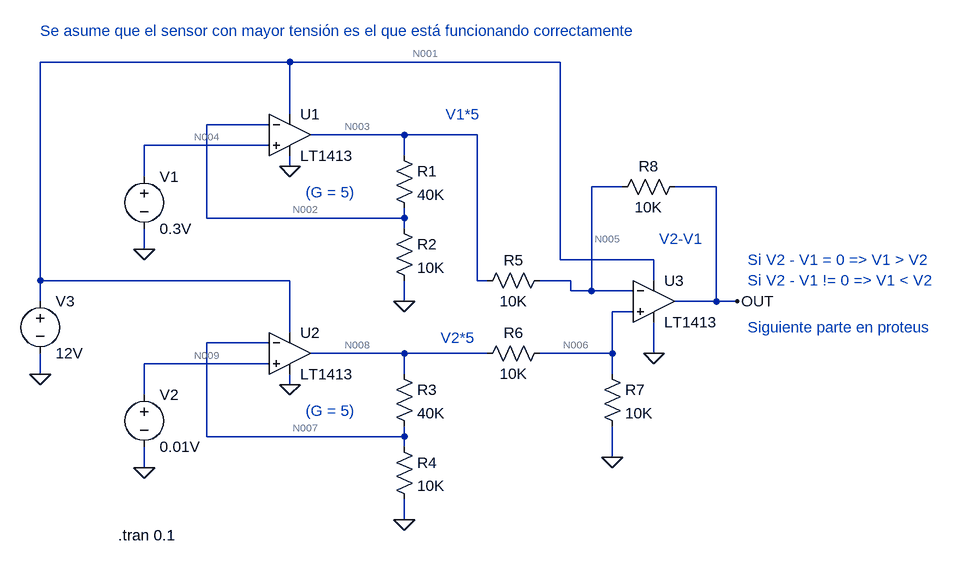
[diagram p0: schematic Draft2.asc]
Draft2.asc, the LTspice schematic file:
Version 4.1
SHEET 1 1600 708
WIRE 320 -48 -64 -48
WIRE 736 -48 320 -48
WIRE 320 32 320 -48
WIRE 288 48 192 48
WIRE 496 64 352 64
WIRE 608 64 496 64
WIRE 288 80 96 80
WIRE 496 96 496 64
WIRE 320 112 320 96
WIRE 96 128 96 80
WIRE 832 144 784 144
WIRE 976 144 912 144
WIRE 192 192 192 48
WIRE 496 192 496 176
WIRE 496 192 192 192
WIRE 496 208 496 192
WIRE 96 240 96 208
WIRE 736 256 736 -48
WIRE 880 256 736 256
WIRE -64 288 -64 -48
WIRE 320 288 -64 288
WIRE 608 288 608 64
WIRE 624 288 608 288
WIRE 752 288 704 288
WIRE 880 288 880 256
WIRE 752 304 752 288
WIRE 784 304 784 144
WIRE 784 304 752 304
WIRE 848 304 784 304
WIRE -64 320 -64 288
WIRE 496 320 496 288
WIRE 976 320 976 144
WIRE 976 320 912 320
WIRE 1008 320 976 320
WIRE 848 336 816 336
WIRE 320 368 320 288
WIRE 288 384 192 384
WIRE 496 400 352 400
WIRE 624 400 496 400
WIRE 816 400 816 336
WIRE 816 400 704 400
WIRE 880 400 880 352
WIRE 288 416 96 416
WIRE -64 432 -64 400
WIRE 496 432 496 400
WIRE 816 432 816 400
WIRE 320 448 320 432
WIRE 96 464 96 416
WIRE 192 528 192 384
WIRE 496 528 496 512
WIRE 496 528 192 528
WIRE 496 544 496 528
WIRE 816 560 816 512
WIRE 96 576 96 544
WIRE 496 656 496 624
FLAG 96 240 0
FLAG 496 320 0
FLAG 320 112 0
FLAG 96 576 0
FLAG 496 656 0
FLAG 320 448 0
FLAG -64 432 0
FLAG 816 560 0
FLAG 880 400 0
FLAG 1008 320 OUT
SYMBOL voltage 96 112 R0
SYMATTR InstName V1
SYMATTR Value 0.3V
SYMBOL OpAmps\\LT1413 320 0 R0
SYMATTR InstName U1
SYMBOL res 480 80 R0
SYMATTR InstName R1
SYMATTR Value 40K
SYMBOL res 480 192 R0
SYMATTR InstName R2
SYMATTR Value 10K
SYMBOL voltage 96 448 R0
WINDOW 123 0 0 Left 0
WINDOW 39 0 0 Left 0
SYMATTR InstName V2
SYMATTR Value 0.01V
SYMBOL OpAmps\\LT1413 320 336 R0
SYMATTR InstName U2
SYMBOL res 480 416 R0
SYMATTR InstName R3
SYMATTR Value 40K
SYMBOL res 480 528 R0
SYMATTR InstName R4
SYMATTR Value 10K
SYMBOL voltage -64 304 R0
SYMATTR InstName V3
SYMATTR Value 12V
SYMBOL res 720 272 R90
WINDOW 0 0 56 VBottom 2
WINDOW 3 32 56 VTop 2
SYMATTR InstName R5
SYMATTR Value 10K
SYMBOL res 720 384 R90
WINDOW 0 0 56 VBottom 2
WINDOW 3 32 56 VTop 2
SYMATTR InstName R6
SYMATTR Value 10K
SYMBOL OpAmps\\LT1413 880 256 R0
SYMATTR InstName U3
SYMBOL res 800 416 R0
SYMATTR InstName R7
SYMATTR Value 10K
SYMBOL res 928 128 R90
WINDOW 0 0 56 VBottom 2
WINDOW 3 32 56 VTop 2
SYMATTR InstName R8
SYMATTR Value 10K
TEXT 56 680 Left 2 !.tran 0.1
TEXT 344 152 Left 2 ;(G = 5)
TEXT 344 488 Left 2 ;(G = 5)
TEXT 560 32 Left 2 ;V1*5
TEXT 552 376 Left 2 ;V2*5
TEXT 888 224 Left 2 ;V2-V1
TEXT -64 -96 Left 2 ;Se asume que el sensor con mayor tensión es el que está funcionando correctamente
TEXT 1024 256 Left 2 ;Si V2 - V1 = 0 => V1 > V2\nSi V2 - V1 != 0 => V1 < V2
TEXT 1024 360 Left 2 ;Siguiente parte en proteus

The netlist it stands for:
* Draft2.asc
V1 N004 0 0.3V
X§U1 N004 N002 N001 0 N003 LT1413  ; pins In+ In- V+ V- OUT
R1 N003 N002 40K
R2 N002 0 10K
V2 N009 0 0.01V
X§U2 N009 N007 N001 0 N008 LT1413  ; pins In+ In- V+ V- OUT
R3 N008 N007 40K
R4 N007 0 10K
V3 N001 0 12V
R5 N005 N003 10K
R6 N006 N008 10K
X§U3 N006 N005 N001 0 OUT LT1413  ; pins In+ In- V+ V- OUT
R7 N006 0 10K
R8 OUT N005 10K
.tran 0.1
* (G = 5)
* (G = 5)
* V1*5
* V2*5
* V2-V1
* Se asume que el sensor con mayor tensión es el que está funcionando correctamente
* Si V2 - V1 = 0 => V1 > V2
* Si V2 - V1 != 0 => V1 < V2
* Siguiente parte en proteus
.lib LTC.lib
.backanno
.end

* Results of the author's LTspice run, read from the files saved beside the schematic
* Operating Point, zero values left out:
*   V(n002) = 300 mV
*   V(n003) = 1.5 V
*   V(n009) = 10 mV
*   V(n008) = 91.61 mV
*   V(out) = 69.53 mV
*   V(n004) = 300 mV
*   V(n001) = 12 V
*   V(n007) = 18.42 mV
*   V(n005) = 784.6 mV
*   V(n006) = 45.87 mV
*   I(V1) = 12.57 nA
*   I(R2) = 30 µA
*   I(R4) = 1.842 µA
*   I(R5) = -71.49 µA
*   I(R6) = -4.573 µA
*   I(R8) = -71.5 µA
*   I(R3) = 1.83 µA
*   I(R7) = 4.587 µA
*   I(R1) = 29.99 µA
*   I(V2) = 12.62 nA
*   I(V3) = -1.045 mA
*   Ix(u2:1) = -12.62 nA
*   Ix(u2:2) = -12.58 nA
*   Ix(u2:3) = 352.1 µA
*   Ix(u2:4) = -345.4 µA
*   Ix(u2:5) = -6.403 µA
*   Ix(u1:1) = -12.57 nA
*   Ix(u1:2) = -12.57 nA
*   Ix(u1:3) = 402.6 µA
*   Ix(u1:4) = -301.1 µA
*   Ix(u1:5) = -101.5 µA
*   Ix(u3:1) = -14.29 nA
*   Ix(u3:2) = -10.82 nA
*   Ix(u3:3) = 289.8 µA
*   Ix(u3:4) = -359.9 µA
*   Ix(u3:5) = 71.5 µA